# EAGLE schematic Bit Reactor modular v1.0 (EAGLE 6.1)
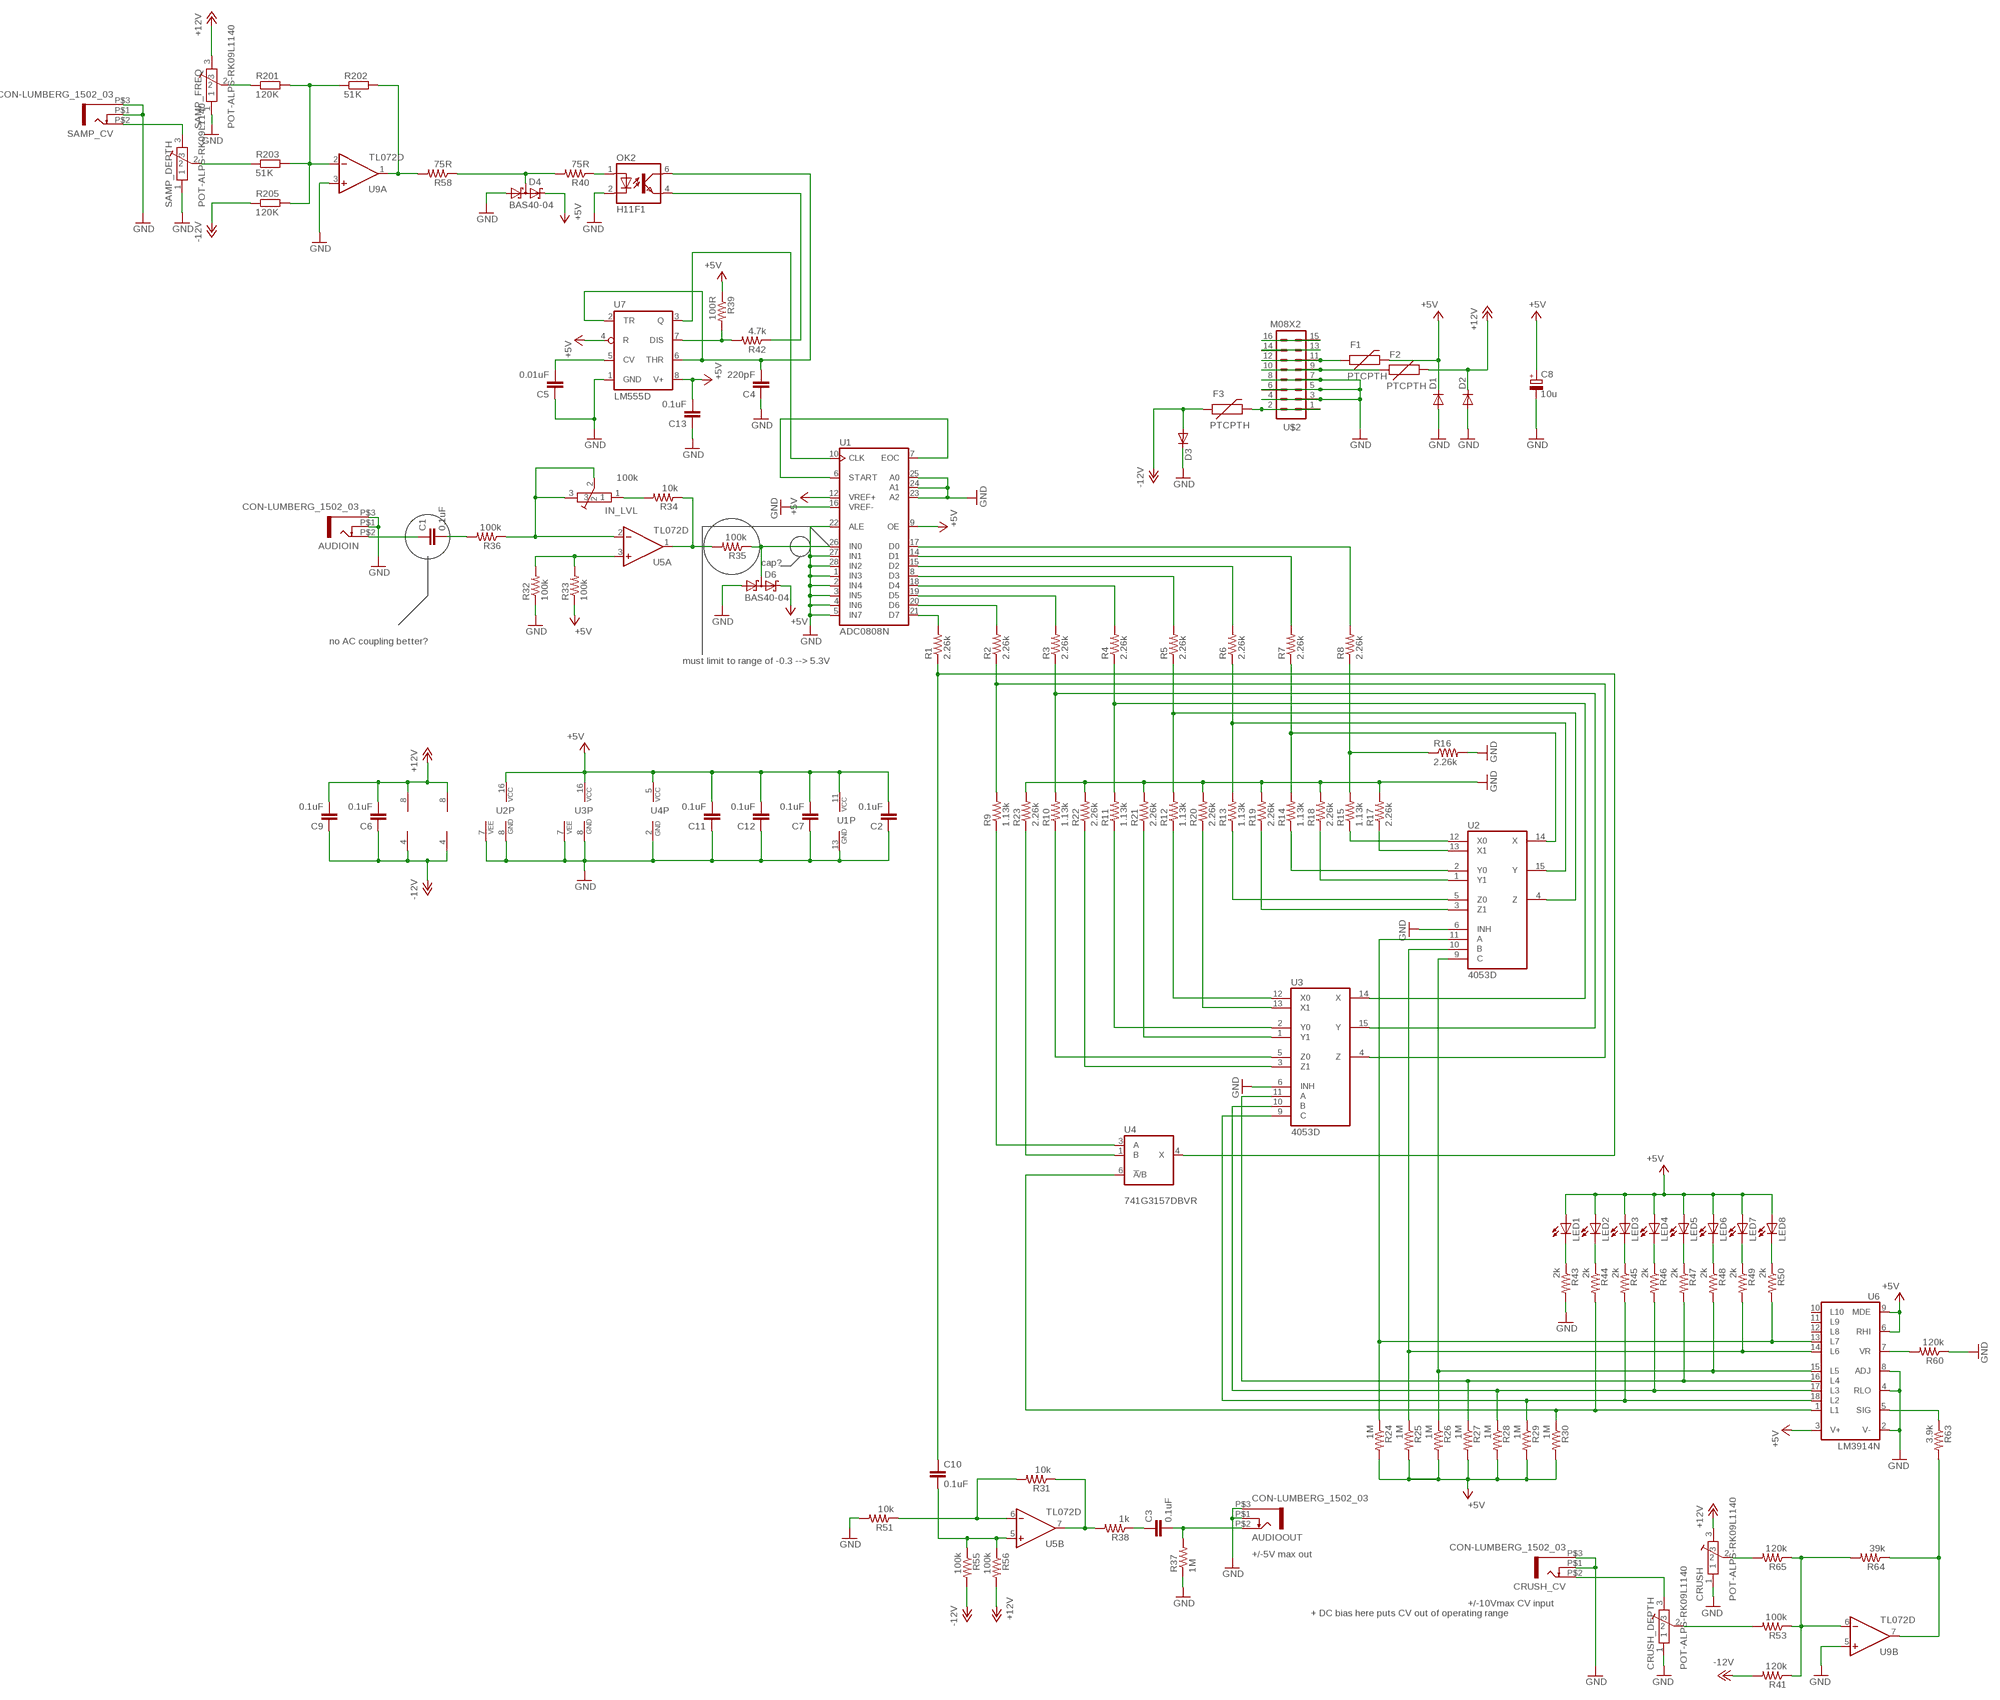
[diagram p0: schematic, sheet 1]

## Parts
AUDIOIN  CON-LUMBERG_1502_03  [CON-LUMBERG_1502_03]
AUDIOOUT  CON-LUMBERG_1502_03  [CON-LUMBERG_1502_03]
C1  0.1uF  C-EU025-030X050  [C025-030X050]
C2  0.1uF  C-EU025-030X050  [C025-030X050]
C3  0.1uF  C-EU025-025X050  [C025-025X050]
C4  220pF  C-EU025-030X050  [C025-030X050]
C5  0.01uF  C-EU025-030X050  [C025-030X050]
C6  0.1uF  C-EU025-030X050  [C025-030X050]
C7  0.1uF  C-EU025-030X050  [C025-030X050]
C8  10u  CPOL-EUE5-6  [E5-6]
C9  0.1uF  C-EU025-030X050  [C025-030X050]
C10  0.1uF  C-EU025-030X050  [C025-030X050]
C11  0.1uF  C-EU025-030X050  [C025-030X050]
C12  0.1uF  C-EU025-030X050  [C025-030X050]
C13  0.1uF  C-EU025-030X050  [C025-030X050]
CRUSH  POT-ALPS-RK09L1140  [POT-ALPS-RK09L1140]
CRUSH_CV  CON-LUMBERG_1502_03  [CON-LUMBERG_1502_03]
CRUSH_DEPTH  POT-ALPS-RK09L1140  [POT-ALPS-RK09L1140]
D1  DIODE1N4001  [DIODE-1N4001]
D2  DIODE1N4001  [DIODE-1N4001]
D3  DIODE1N4001  [DIODE-1N4001]
D4  BAS40-04  [SOT23]
D6  BAS40-04  [SOT23]
F1  PTCPTH  [PTC]
F2  PTCPTH  [PTC]
F3  PTCPTH  [PTC]
IN_LVL  100k  POT-ALPS-RK09L1140  [POT-ALPS-RK09L1140]
LED1  LED3MM  [LED3MM]
LED2  LED3MM  [LED3MM]
LED3  LED3MM  [LED3MM]
LED4  LED3MM  [LED3MM]
LED5  LED3MM  [LED3MM]
LED6  LED3MM  [LED3MM]
LED7  LED3MM  [LED3MM]
LED8  LED3MM  [LED3MM]
OK2  H11F1  [DIL05]
R1  2.26k  R-US_R0805W  [R0805W]
R2  2.26k  R-US_R0805W  [R0805W]
R3  2.26k  R-US_R0805W  [R0805W]
R4  2.26k  R-US_R0805W  [R0805W]
R5  2.26k  R-US_R0805W  [R0805W]
R6  2.26k  R-US_R0805W  [R0805W]
R7  2.26k  R-US_R0805W  [R0805W]
R8  2.26k  R-US_R0805W  [R0805W]
R9  1.13k  R-US_R0805W  [R0805W]
R10  1.13k  R-US_R0805W  [R0805W]
R11  1.13k  R-US_R0805W  [R0805W]
R12  1.13k  R-US_R0805W  [R0805W]
R13  1.13k  R-US_R0805W  [R0805W]
R14  1.13k  R-US_R0805W  [R0805W]
R15  1.13k  R-US_R0805W  [R0805W]
R16  2.26k  R-US_R0805W  [R0805W]
R17  2.26k  R-US_R0805W  [R0805W]
R18  2.26k  R-US_R0805W  [R0805W]
R19  2.26k  R-US_R0805W  [R0805W]
R20  2.26k  R-US_R0805W  [R0805W]
R21  2.26k  R-US_R0805W  [R0805W]
R22  2.26k  R-US_R0805W  [R0805W]
R23  2.26k  R-US_R0805W  [R0805W]
R24  1M  R-US_R0402  [R0402]
R25  1M  R-US_R0402  [R0402]
R26  1M  R-US_R0402  [R0402]
R27  1M  R-US_R0402  [R0402]
R28  1M  R-US_R0402  [R0402]
R29  1M  R-US_R0402  [R0402]
R30  1M  R-US_R0402  [R0402]
R31  10k  R-US_0207/10  [0207/10]
R32  100k  R-US_0207/10  [0207/10]
R33  100k  R-US_0207/10  [0207/10]
R34  10k  R-US_0207/10  [0207/10]
R35  100k  R-US_0207/10  [0207/10]
R36  100k  R-US_0207/10  [0207/10]
R37  1M  R-US_R0402  [R0402]
R38  1k  R-US_0207/10  [0207/10]
R39  100R  R-US_0207/10  [0207/10]
R40  75R  R-US_0207/10  [0207/10]
R41  120k  R-US_0207/10  [0207/10]
R42  4.7k  R-US_0207/10  [0207/10]
R43  2k  R-US_0207/7  [0207/7]
R44  2k  R-US_0207/7  [0207/7]
R45  2k  R-US_0207/7  [0207/7]
R46  2k  R-US_0207/7  [0207/7]
R47  2k  R-US_0207/7  [0207/7]
R48  2k  R-US_0207/10  [0207/10]
R49  2k  R-US_0207/7  [0207/7]
R50  2k  R-US_0207/7  [0207/7]
R51  10k  R-US_0207/10  [0207/10]
R53  100k  R-US_0207/10  [0207/10]
R55  100k  R-US_0207/10  [0207/10]
R56  100k  R-US_0207/10  [0207/10]
R58  75R  R-US_0207/10  [0207/10]
R60  120k  R-US_0207/10  [0207/10]
R63  3.9k  R-US_0207/10  [0207/10]
R64  39k  R-US_0207/10  [0207/10]
R65  120k  R-US_0207/10  [0207/10]
R201  120K  R-EU_0204/7  [0204/7]
R202  51K  R-EU_0204/7  [0204/7]
R203  51K  R-EU_0204/7  [0204/7]
R205  120K  R-EU_0204/7  [0204/7]
SAMP_CV  CON-LUMBERG_1502_03  [CON-LUMBERG_1502_03]
SAMP_DEPTH  POT-ALPS-RK09L1140  [POT-ALPS-RK09L1140]
SAMP_FREQ  POT-ALPS-RK09L1140  [POT-ALPS-RK09L1140]
U1  ADC0808N  [DIL28-6]
U2  4053D  [SO16]
U3  4053D  [SO16]
U4  741G3157DBVR  [DBV_R-PDSO-G6]
U5  TL072D  [SO08]
U6  LM3914N  [DIL18]
U7  LM555D  [SO08]
U9  TL072D  [SO08]
U$2  M08X2  [2X8]

## Nets
+5V: C2.2 C7.2 C8.+ C11.2 C12.2 C13.2 D1.C D4.2(C2) D6.2(C2) F1.P$2 LED1.A LED2.A LED3.A LED4.A LED5.A LED6.A LED7.A LED8.A R24.2 R25.2 R26.2 R27.2 R28.2 R29.2 R30.2 R33.1 R39.1 U1.9(OE) U1.11(VCC) U1.12(VREF+) U2.16(VCC) U3.16(VCC) U4.5(VCC) U6.3(V+) U6.6(RHI) U6.9(MDE) U7.4(R) U7.8(V+)
+12V: C6.2 C9.2 CRUSH.3 D2.C F2.P$2 R56.2 SAMP_FREQ.3 U5.8(P:V+) U9.8(P:V+)
-12V: C6.1 C9.1 D3.A F3.P$1 R41.2 R55.2 R205.1 U5.4(P:V-) U9.4(P:V-)
CV2IN: R63.2 R64.1 U9.7(B:OUT)
GND: AUDIOIN.P$1 AUDIOIN.P$3 AUDIOOUT.P$1 AUDIOOUT.P$3 C2.1 C4.1 C5.1 C7.1 C8.- C11.1 C12.1 C13.1 CRUSH.1 CRUSH_CV.P$1 CRUSH_CV.P$3 CRUSH_DEPTH.1 D1.A D2.A D3.C D4.1(A1) D6.1(A1) OK2.2(C) R16.2 R17.2 R18.2 R19.2 R20.2 R21.2 R22.2 R23.2 R32.1 R37.1 R43.2 R51.2 R60.1 SAMP_CV.P$1 SAMP_CV.P$3 SAMP_DEPTH.1 SAMP_FREQ.1 U1.1(IN3) U1.2(IN4) U1.3(IN5) U1.4(IN6) U1.5(IN7) U1.13(GND) U1.16(VREF-) U1.22(ALE) U1.23(A2) U1.24(A1) U1.25(A0) U1.27(IN1) U1.28(IN2) U2.6(INH) U2.7(VEE) U2.8(GND) U3.6(INH) U3.7(VEE) U3.8(GND) U4.2(GND) U6.2(V-) U6.4(RLO) U6.8(ADJ) U7.1(GND) U9.3(A:+IN) U9.5(B:+IN) U$2.3 U$2.4 U$2.5 U$2.6 U$2.7 U$2.8
N$1: R1.2 U1.21(D7)
N$2: R2.2 U1.20(D6)
N$3: R3.2 U1.19(D5)
N$4: R4.2 U1.18(D4)
N$5: R5.2 U1.8(D3)
N$6: R6.2 U1.15(D2)
N$7: R7.2 U1.14(D1)
N$8: R8.2 U1.17(D0)
N$9: R2.1 R9.2 U3.4(Z)
N$10: R3.1 R10.2 U3.15(Y)
N$11: R4.1 R11.2 U3.14(X)
N$12: R5.1 R12.2 U2.4(Z)
N$13: R12.1 U3.12(X0)
N$14: R11.1 U3.2(Y0)
N$15: R10.1 U3.5(Z0)
N$16: R9.1 U4.3(A)
N$17: R15.1 U2.12(X0)
N$18: R8.1 R15.2 R16.1
N$19: R17.1 U2.13(X1)
N$20: IN_LVL.1 R34.2
N$21: R14.1 U2.2(Y0)
N$22: R13.1 U2.5(Z0)
N$23: R18.1 U2.1(Y1)
N$24: R19.1 U2.3(Z1)
N$25: R20.1 U3.13(X1)
N$26: R21.1 U3.1(Y1)
N$27: R22.1 U3.3(Z1)
N$28: C10.1 R1.1 U4.4(X)
N$29: OK2.1(A) R40.1
N$30: U$2.13 U$2.14
N$31: R30.1 R44.2 U4.6(!A!/B) U6.1(L1)
N$32: R29.1 R45.2 U3.9(C) U6.18(L2)
N$33: R28.1 R46.2 U3.10(B) U6.17(L3)
N$34: R27.1 R47.2 U3.11(A) U6.16(L4)
N$35: R26.1 R48.2 U2.9(C) U6.15(L5)
N$36: R25.1 R49.2 U2.10(B) U6.14(L6)
N$37: R24.1 R50.2 U2.11(A) U6.13(L7)
N$38: R34.1 R35.2 U5.1(A:OUT)
N$39: R32.2 R33.2 U5.3(A:+IN)
N$40: IN_LVL.2 IN_LVL.3 R36.1 U5.2(A:-IN)
N$41: F1.P$1 U$2.11 U$2.12
N$42: C1.2 R36.2
N$43: R31.1 R38.2 U5.7(B:OUT)
N$44: C3.1 R38.1
N$45: U1.6(START) U1.7(EOC)
N$46: AUDIOIN.P$2 C1.1
N$47: CRUSH_DEPTH.2 R53.2
N$48: CRUSH_CV.P$2 CRUSH_DEPTH.3
N$49: R39.2 R42.2 U7.7(DIS)
N$51: F2.P$1 U$2.9 U$2.10
N$52: C5.2 U7.5(CV)
N$53: LED1.K(C) R43.1
N$54: U1.10(CLK) U7.3(Q)
N$55: R31.2 R51.1 U5.6(B:-IN)
N$56: LED2.K(C) R44.1
N$57: LED3.K(C) R45.1
N$58: LED4.K(C) R46.1
N$59: LED5.K(C) R47.1
N$60: LED6.K(C) R48.1
N$61: LED7.K(C) R49.1
N$62: LED8.K(C) R50.1
N$63: D6.3(C1A2) R35.1 U1.26(IN0)
N$64: R7.1 R14.2 U2.14(X)
N$65: R6.1 R13.2 U2.15(Y)
N$66: C10.2 R55.1 R56.1 U5.5(B:+IN)
N$67: R23.1 U4.1(B)
N$70: F3.P$2 U$2.1 U$2.2
N$71: R201.2 R202.1 R203.2 R205.2 U9.2(A:-IN)
N$72: R201.1 SAMP_FREQ.2
N$73: R58.2 R202.2 U9.1(A:OUT)
N$74: R203.1 SAMP_DEPTH.2
N$75: SAMP_CV.P$2 SAMP_DEPTH.3
N$79: R60.2 U6.7(VR)
N$80: R63.1 U6.5(SIG)
N$81: R41.1 R53.1 R64.2 R65.1 U9.6(B:-IN)
N$82: D4.3(C1A2) R40.2 R58.1
N$83: CRUSH.2 R65.2
OUT: AUDIOOUT.P$2 C3.2 R37.2
PWR_BUS: U$2.15 U$2.16
Y: OK2.4(EMIT) R42.1
Z: C4.2 OK2.6(COL) U7.2(TR) U7.6(THR)
Unconnected: CRUSH.P$5 CRUSH.P$6 CRUSH_DEPTH.P$5 CRUSH_DEPTH.P$6 IN_LVL.P$5 IN_LVL.P$6 SAMP_DEPTH.P$5 SAMP_DEPTH.P$6 SAMP_FREQ.P$5 SAMP_FREQ.P$6 U6.10(L10) U6.11(L9) U6.12(L8)

## Notes on the sheet
- cap?
- no AC coupling better?
- must limit to range of -0.3 --> 5.3V
- +/-5V max out
- +/-10Vmax CV input
- + DC bias here puts CV out of operating range

## Library data of the parts
AUDIOIN AUDIOOUT CRUSH_CV SAMP_CV = Rebel:CON-LUMBERG_1502_03
C1-C7 C9-C13 = resistor:C-EU: CAPACITOR, European symbol
C8 = rcl:CPOL-EU: POLARIZED CAPACITOR, European symbol
CRUSH CRUSH_DEPTH IN_LVL SAMP_DEPTH SAMP_FREQ = Rebel:POT-ALPS-RK09L
D1-D3 = Rebel:DIODE: Diode These are standard reverse protection diodes and small signal diodes. SMA package can handle up to about 1A. SOD-323 can handle about 200mA. Watch the SOD-323 package when ordering, there are some mfgs out there that are 5-pin packages.
D4 D6 = diode:BAS40-04: Silicon Schottky Diodes General-purpose diode for high-speed switching
F1-F3 = Rebel:PTC: Resettable Fuse PTC Resettable Fuse. Bourns MF-R, Raychem PolySwitch RXE.
LED1-LED8 = led:LED: LED OSRAM: - CHIPLED LG R971, LG N971, LY N971, LG Q971, LY Q971, LO R971, LY R971 LH N974, LH R974 LS Q976, LO Q976, LY Q976 LO Q996 - Hyper CHIPLED LW Q18S LB Q993, LB Q99A, LB R99A - SideLED LS A670, LO A670, LY A670, LG A670, LP A670 LB A673, LV A673, LT A673, LW A673 LH A674 LY A675 LS A676, LA A676, LO A676, LY A676, LW A676 LS A679, LY A679, LG A679 - Hyper Micro SIDELED® LS Y876, LA Y876, LO Y876, LY Y876 LT Y87S - SmartLED LW L88C, LW L88S LB L89C, LB L89S, LG L890 LS L89K, LO L89K, LY L89K LS L896, LA L896, LO L896, LY L896 - TOPLED LS T670, LO T670, LY T670, LG T670, LP T670 LSG T670, LSP T670, LSY T670, LOP T670, LYG T670 LG T671, LOG T671, LSG T671 LB T673, LV T673, LT T673, LW T673 LH T674 LS T676, LA T676, LO T676, LY T676, LB T676, LH T676, LSB T676, LW T676 LB T67C, LV T67C, LT T67C, LS T67K, LO T67K, LY T67K, LW E67C LS E67B, LA E67B, LO E67B, LY E67B, LB E67C, LV E67C, LT E67C LW T67C LS T679, LY T679, LG T679 LS T770, LO T770, LY T770, LG T770, LP T770 LB T773, LV T773, LT T773, LW T773 LH T774 LS E675, LA E675, LY E675, LS T675 LS T776, LA T776, LO T776, LY T776, LB T776 LHGB T686 LT T68C, LB T68C - Hyper Mini TOPLED® LB M676 - Mini TOPLED Santana® LG M470 LS M47K, LO M47K, LY M47K Source: http://www.osram.convergy.de LUXEON: - LUMILED® LXK2-PW12-R00, LXK2-PW12-S00, LXK2-PW14-U00, LXK2-PW14-V00 LXK2-PM12-R00, LXK2-PM12-S00, LXK2-PM14-U00 LXK2-PE12-Q00, LXK2-PE12-R00, LXK2-PE12-S00, LXK2-PE14-T00, LXK2-PE14-U00 LXK2-PB12-K00, LXK2-PB12-L00, LXK2-PB12-M00, LXK2-PB14-N00, LXK2-PB14-P00, LXK2-PB14-Q00 LXK2-PR12-L00, LXK2-PR12-M00, LXK2-PR14-Q00, LXK2-PR14-R00 LXK2-PD12-Q00, LXK2-PD12-R00, LXK2-PD12-S00 LXK2-PH12-R00, LXK2-PH12-S00 LXK2-PL12-P00, LXK2-PL12-Q00, LXK2-PL12-R00 Source: www.luxeon.com KINGBRIGHT: KA-3528ASYC Source: www.kingbright.com
OK2 = optocoupler:H11F1: OPTO COUPLER OPTO COUPLER; OC_FARNELL: unknown; OC_NEWARK: unknown
R1-R51 R53 R55 R56 R58 R60 R63-R65 = resistor:R-US_: RESISTOR, American symbol
R201-R203 R205 = Rebel:R-EU_: RESISTOR, European symbol
U1 = linear:ADC0808: 8-bit A/D CONVERTER with 8-channel multiplexer
U2 U3 = 40xx:4053: Triple 2-channel ANALOG MULTIPLEXER
U4 = 74xx-little-us:74*1G3157: Single-Pole, Double-Throw Analog Switch Source: http://focus.ti.com/lit/ds/symlink/sn74lvc1g3157.pdf
U5 U9 = linear:TL072: OP AMP
U6 = linear:LM3914N: LED DRIVER senses analog voltage levels and drives 10 LEDs
U7 = linear:*555: TIMER
U$2 = SparkFun:M08X2